# Altium schematic sheet IO_Boardv3_281215.SchDoc
size A3
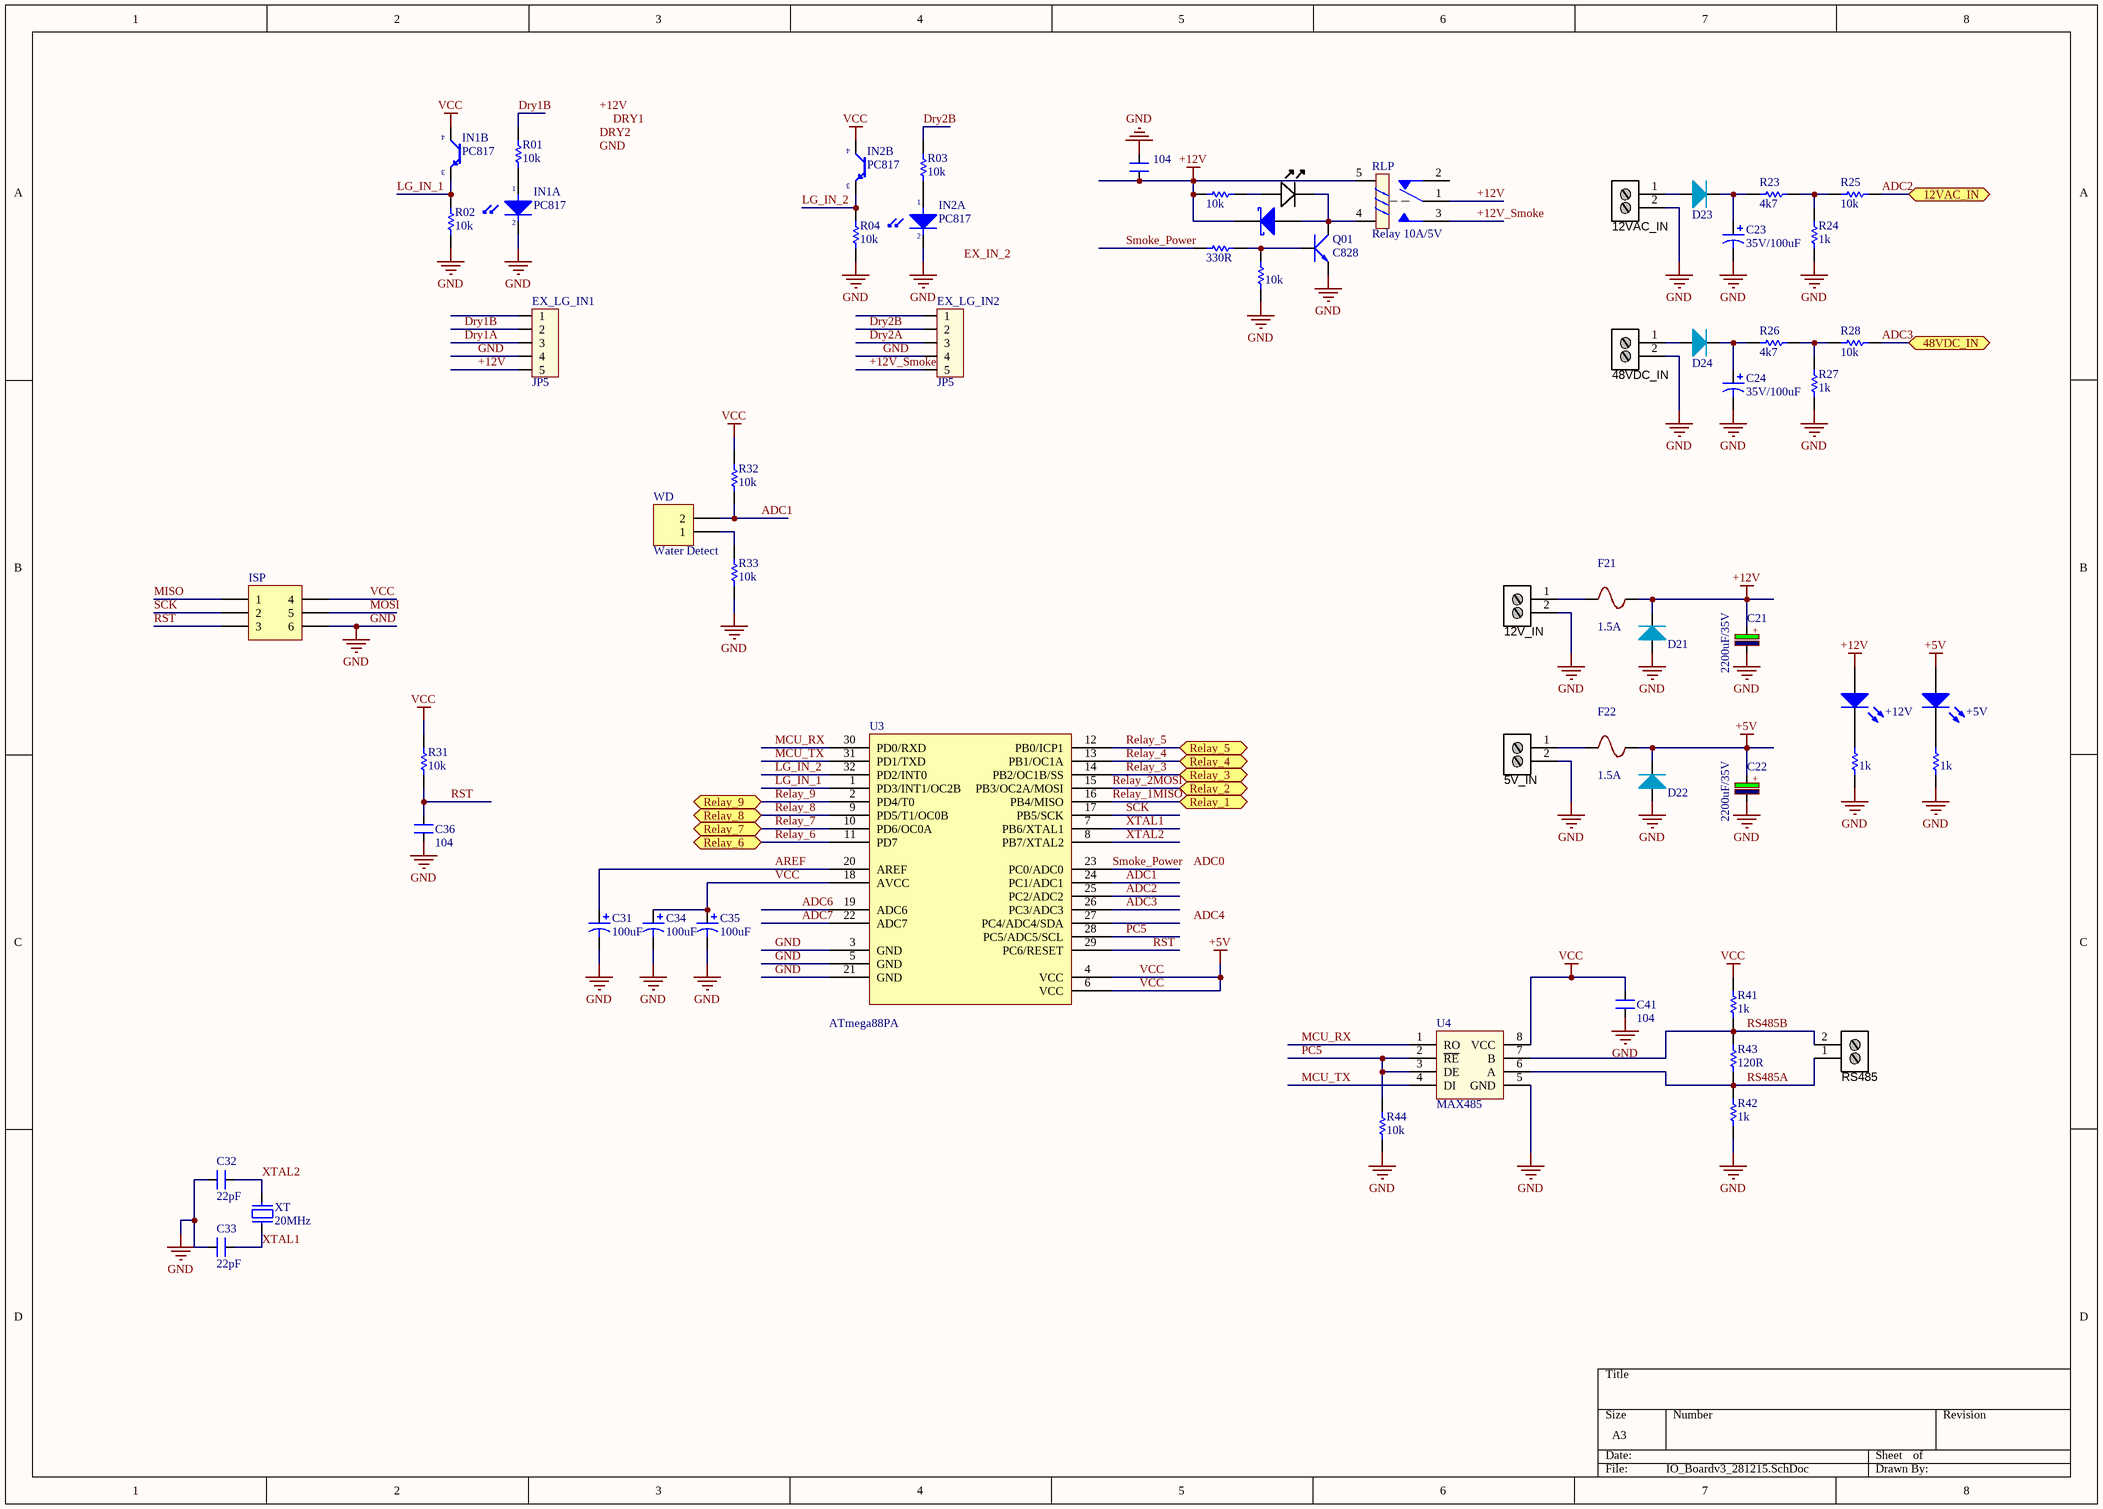
[diagram p0: IO_Boardv3_281215.SchDoc]

## Parts
5V_IN  Stackable ScrewTerm  [2P_PCB_ScrewTerm_200mil]  (value not drawn)
12V_IN  Stackable ScrewTerm  [2P_PCB_ScrewTerm_200mil]  (value not drawn)
12VAC_IN  Stackable ScrewTerm  [2P_PCB_ScrewTerm_200mil]  (value not drawn)
48VDC_IN  Stackable ScrewTerm  [2P_PCB_ScrewTerm_200mil]  (value not drawn)
+5V  Led  [LED 5mm RED]  (value not drawn)
+12V  Led  [LED 5mm RED]  (value not drawn)
C01  value 104  [CAPC2012N_F]  (hidden comment: CAP NP)
C21  2200uF/35V  [CP_1000uF_25V]
C22  2200uF/35V  [CP_1000uF_25V]
C23  value 35V/100uF  [CAP_ELEC_6.3x4.2]  (hidden comment: Cap)
C24  value 35V/100uF  [CAP_ELEC_6.3x4.2]  (hidden comment: Cap)
C31  value 100uF  [CAPC2012N_F]  (hidden comment: Cap)
C32  value 22pF  [CAPC1608N]  (hidden comment: CAP NP)
C33  value 22pF  [CAPC1608N]  (hidden comment: CAP NP)
C34  value 100uF  [CAPC2012N_F]  (hidden comment: Cap)
C35  value 100uF  [CAPC2012N_F]  (hidden comment: Cap)
C36  value 104  [CAPC1608N]  (hidden comment: CAP NP)
C41  value 104  [CAPC2012N_F]  (hidden comment: 100nF/104)
D01  Diode  [DO-214AC]  (value not drawn)
D21  Diode  [DO-214AC]  (value not drawn)
D22  Diode  [DO-214AC]  (value not drawn)
D23  Diode  [DO-214AC]  (value not drawn)
D24  Diode  [DO-214AC]  (value not drawn)
E01  Blue  [LED-0805-A]  (value not drawn)
EX_LG_IN1  JP5  [CON5]
EX_LG_IN2  JP5  [CON5]
F21  1.5A  [FUSE_SR-5-BK]
F22  1.5A  [FUSE_SR-5-BK]
IN1  PC817  [DIP4/W0.3]  (parts A,B of 2)
IN2  PC817  [DIP4/W0.3]  (parts A,B of 2)
ISP  Header 3X2A  [HDR2X3_CEN]  (value not drawn)
Q01  C828  [SOT23 TOP]
R01  value 10k  [RESC2012N_F]  (hidden comment: Res)
R02  value 10k  [RESC2012N_F]  (hidden comment: Res)
R03  value 10k  [RESC2012N_F]  (hidden comment: Res)
R04  value 10k  [RESC2012N_F]  (hidden comment: Res)
R05  value 10k  [RESC1608N_ZERO]  (hidden comment: Res)
R06  value 10k  [RESC1608N_ZERO]  (hidden comment: Res)
R07  value 330R  [RESC1608N_ZERO]  (hidden comment: Res)
R21  value 1k  [RESC2012N_F]  (hidden comment: Res_0805_1k)
R22  value 1k  [RESC2012N_F]  (hidden comment: Res_0805_1k)
R23  value 4k7  [RESC2012N_F]  (hidden comment: Res)
R24  value 1k  [RESC2012N_F]  (hidden comment: Res)
R25  value 10k  [RESC2012N_F]  (hidden comment: Res)
R26  value 4k7  [RESC2012N_F]  (hidden comment: Res)
R27  value 1k  [RESC2012N_F]  (hidden comment: Res)
R28  value 10k  [RESC2012N_F]  (hidden comment: Res)
R31  value 10k  [RESC1608N_ZERO]  (hidden comment: Res)
R32  value 10k  [RESC2012N_F]  (hidden comment: Res)
R33  value 10k  [RESC2012N_F]  (hidden comment: Res)
R41  1k  [RESC2012N_F]
R42  1k  [RESC2012N_F]
R43  value 120R  [RESC2012N_F]  (hidden comment: 330R)
R44  value 10k  [RESC2012N_F]  (hidden comment: 330R)
RLP  Relay 10A/5V  [RL_5PIN]
RS485  Stackable ScrewTerm  [2P_PCB1]  (value not drawn)
U3  ATmega88PA  [32PIN]
U4  MAX485  [SO-8]
WD  Water Detect  [HDR1X2]
XT  20MHz  [XT2]

## Ports
12VAC_IN, 48VDC_IN, Relay_1, Relay_2, Relay_3, Relay_4, Relay_5, Relay_6, Relay_7, Relay_8, Relay_9

## Nets
+12V: +12V.1(A) C01.1 C21.1 D01.2(K) D21.2(K) EX_LG_IN1.5 F21.2 R05.2 RLP.1 RLP.5
GND: 5V_IN.2 12V_IN.2 12VAC_IN.2 48VDC_IN.2 C01.2 C21.2 C22.2 C23.2 C24.2 C31.2 C32.2 C33.2 C34.2 C35.2 C36.1 C41.1 D21.1(A) D22.1(A) EX_LG_IN1.4 EX_LG_IN2.4 IN1.2(K) IN2.2(K) ISP.6 Q01.3(E) R02.1 R04.1 R06.1 R21.2 R22.2 R24.1 R27.1 R33.1 R42.1 R44.1 U3.3(GND) U3.5(GND) U3.21(GND) U4.5(GND)
VCC: +5V.1(A) C22.1 C34.1 C35.1 C41.2 D22.2(K) F22.2 IN1.4(C) IN2.4(C) ISP.4 R31.2 R32.2 R41.2 U3.4(VCC) U3.6(VCC) U3.18(AVCC) U4.8(VCC)  [also labelled +5V]
+12V_Smoke: EX_LG_IN2.5 RLP.3
ADC1: R32.1 U3.24(PC1/ADC1) WD.2
ADC2: R25.2 U3.25(PC2/ADC2) ; port 12VAC_IN
ADC3: R28.2 U3.26(PC3/ADC3) ; port 48VDC_IN
ADC6: U3.19(ADC6)
ADC7: U3.22(ADC7)
AREF: C31.1 U3.20(AREF)
Dry1A: EX_LG_IN1.3
Dry1B: EX_LG_IN1.2 R01.2
Dry2A: EX_LG_IN2.3
Dry2B: EX_LG_IN2.2 R03.2
LG_IN_1: IN1.3(E) R02.2 U3.1(PD3/INT1/OC2B)
LG_IN_2: IN2.3(E) R04.2 U3.32(PD2/INT0)
MCU_RX: U3.30(PD0/RXD) U4.1(RO)
MCU_TX: U3.31(PD1/TXD) U4.4(DI)
MISO: ISP.1 U3.16(PB4/MISO) ; port Relay_1  [also labelled Relay_1]
MOSI: ISP.5 U3.15(PB3/OC2A/MOSI) ; port Relay_2  [also labelled Relay_2]
PC5: R44.2 U3.28(PC5/ADC5/SCL) U4.2(~{RE}) U4.3(DE)
Relay_3: U3.14(PB2/OC1B/SS) ; port Relay_3
Relay_4: U3.13(PB1/OC1A) ; port Relay_4
Relay_5: U3.12(PB0/ICP1) ; port Relay_5
Relay_6: U3.11(PD7) ; port Relay_6
Relay_7: U3.10(PD6/OC0A) ; port Relay_7
Relay_8: U3.9(PD5/T1/OC0B) ; port Relay_8
Relay_9: U3.2(PD4/T0) ; port Relay_9
RS485A: R42.2 R43.1 RS485.1 U4.6(A)
RS485B: R41.1 R43.2 RS485.2 U4.7(B)
RST: C36.2 ISP.3 R31.1 U3.29(PC6/RESET)
SCK: ISP.2 U3.17(PB5/SCK)
Smoke_Power: R07.1 U3.23(PC0/ADC0)
XTAL1: C33.1 U3.7(PB6/XTAL1) XT.1
XTAL2: C32.1 U3.8(PB7/XTAL2) XT.2
Net5V_IN_1: 5V_IN.1 F22.1
Net12V_IN_1: 12V_IN.1 F21.1
Net12VAC_IN_1: 12VAC_IN.1 D23.1(A)
Net48VDC_IN_1: 48VDC_IN.1 D24.1(A)
Net+5V_2: +5V.2(K) R22.1
Net+12V_2: +12V.2(K) R21.1
NetC23_1: C23.1 D23.2(K) R23.1
NetC24_1: C24.1 D24.2(K) R26.1
NetD01_1: D01.1(A) E01.K Q01.2(C) RLP.4
NetE01_A: E01.A R05.1
NetIN1_1: IN1.1(A) R01.1
NetIN2_1: IN2.1(A) R03.1
NetQ01_1: Q01.1(B) R06.2 R07.2
NetR23_2: R23.2 R24.2 R25.1
NetR26_2: R26.2 R27.2 R28.1
NetR33_2: R33.2 WD.1

Not connected (* = marked no-connect by the designer): EX_LG_IN1 1; EX_LG_IN2 1; RLP 2; U3 27(PC4/ADC4/SDA)

## Notes on the sheet
- Labels drawn without touching a wire or pin: +12V, ADC0, ADC4, DRY1, DRY2, EX_IN_2, GND
- (in symbol CP4) +

## Library data of the parts
5V_IN 12V_IN 12VAC_IN 48VDC_IN RS485 = 2P_ScrewTerm_90S_3.81MM: Terminal Block Screw Type THT 2-Position 3.81mm pitch; Manufacturer 1: Tyco Electronics; Manufacturer Part Number 1: 1776113-2; Value: 2 position; Pitch: 0.150" (3.81mm); Positions Per Level: 2; Package / Case: Side Entry; 3.81mm pitch; Category: Connectors Interconnects; Color: Black; Supplier 1: Digi-Key; Supplier Part Number 1: A97976-ND
+5V +12V = Led: pin to pad: 1>A 2>K
C21 C22 = CP4: Cap 1000uF/16V - 220uF/50V; Description 5: 4,7uF>10uF/250V_3,3uF>10uF/400V - 2,2uF>4,7uF/450V; Description 1: 2200uF-3300uF/6,3V - 1000uF-2200uF/10V; Description 2: 1000uF/16V - 470uF => 1000uF/25V - 100uF/100V; Description 3: 330uF>470uF/35V_220uF>470uF/50V_10uF>22uF/250V; Description 4: 220uF => 330uF/63V - 10uF =>33uF/160 - 200V; Value: 1000uF/16V
C41 = CAP NP
D01 D21-D24 = Diode: pin to pad: 1>A 2>K
E01 = LED_SMD_Blue_0805_100mcd: LED 0805 SMD Blue 100mcd 470nm; Manufacturer 1: Ligitek; Manufacturer Part Number 1: LG-170DBKZ-CT; Ratings: 100 mcd; 470 nm; Package / Case: 0805; Material: InGaN/GaN; Value: Blue; Color: Blue
EX_LG_IN1 EX_LG_IN2 = Con5: Connector 5; Value: Connector 5
F21 F22 = Fuse
IN1 IN2 = Opto
ISP = Header 3X2A: Header, 3-Pin, Dual row; LatestRevisionDate: 17-Jul-2002; LatestRevisionNote: Re-released for DXP Platform.; Publisher: Altium Limited
Q01 = NPN: Transistor C828 C1815....
R21 R22 = Res
R41-R44 = Res: Tro dan
  R41 R42: Value: 1k
RLP = Relay 1: Relay SPDT,10A - 12VDC 5 Pin; Value: Relay SPDT, 10A, 12V
U3 = ATmega48/168/328
U4 = MAX485: RS232 - RS485 (Same sn75176)
WD = Header 2: Header, 2-Pin; LatestRevisionDate: 17-Jul-2002; LatestRevisionNote: Re-released for DXP Platform.; Publisher: Altium Limited
XT = Crystal